# EAGLE design shieldSchematic (EAGLE 7.6.0)
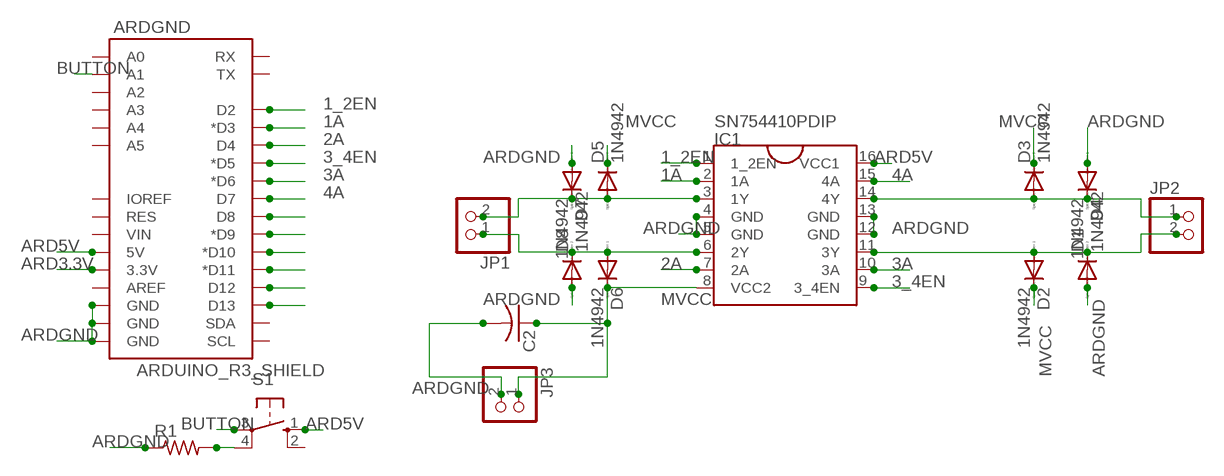
[diagram p0: schematic, sheet 1]

## Parts
ARDGND  ARDUINO_R3_SHIELD  [UNO_R3_SHIELD]
C2  C-US025-024X044  [C025-024X044]
D1  1N4942  [DO41-10]
D2  1N4942  [DO41-10]
D3  1N4942  [DO41-10]
D4  1N4942  [DO41-10]
D5  1N4942  [DO41-10]
D6  1N4942  [DO41-10]
D7  1N4942  [DO41-10]
D8  1N4942  [DO41-10]
IC1  SN754410PDIP  [DIL16]
JP1  PINHD-1X2  [1X02]
JP2  PINHD-1X2  [1X02]
JP3  PINHD-1X2  [1X02]
R1  R-US_0207/10  [0207/10]
S1  40-XX  [B3F-40XX]

## Nets
1_2EN: ARDGND.D2 IC1.1(1_2EN)
1A: ARDGND.D3(*D3) IC1.2(1A)
2A: ARDGND.D4 IC1.7(2A)
3_4EN: ARDGND.D5(*D5) IC1.9(3_4EN)
3A: ARDGND.D6(*D6) IC1.10(3A)
4A: ARDGND.D7 IC1.15(4A)
ARD3.3V: ARDGND.3.3V
ARD5V: ARDGND.5V IC1.16(VCC1) S1.1(S)
ARDGND: ARDGND.GND@0(GND) ARDGND.GND@1(GND) ARDGND.GND@2(GND) C2.2 D1.A D4.A D7.A D8.A IC1.4(GND) IC1.5(GND) IC1.12(GND) IC1.13(GND) JP3.2 R1.1
BUTTON: ARDGND.A1 S1.3(P)
MVCC: C2.1 D2.C D3.C D5.C D6.C IC1.8(VCC2) JP3.1
N$1: D5.A D7.C IC1.3(1Y) JP1.2
N$2: R1.2 S1.4(P1)
N$10: ARDGND.D8
N$11: ARDGND.D9(*D9)
N$12: ARDGND.D10(*D10)
N$13: ARDGND.D11(*D11)
N$14: ARDGND.D12
N$15: ARDGND.D13
N$17: D6.A D8.C IC1.6(2Y) JP1.1
N$18: D1.C D2.A IC1.11(3Y) JP2.2
N$19: D3.A D4.C IC1.14(4Y) JP2.1
Unconnected: ARDGND.A0 ARDGND.A2 ARDGND.A3 ARDGND.A4 ARDGND.A5 ARDGND.AREF ARDGND.IOREF ARDGND.RES ARDGND.RX ARDGND.SCL ARDGND.SDA ARDGND.TX ARDGND.VIN S1.2(S1)

## Library data of the parts
ARDGND = SparkFun-Boards:ARDUINO_R3_SHIELD: Shield form compatible with the Arduino Uno R3.
C2 = rcl:C-US: CAPACITOR, American symbol
D1-D8 = diode:1N4942: DIODE 1.0 A, 200 V, 150 ns
IC1 = AlexW-Eagle-Libraries:SN754410
JP1-JP3 = pinhead:PINHD-1X2: PIN HEADER
R1 = resistor:R-US_: RESISTOR, American symbol
S1 = switch-omron:40-XX: OMRON SWITCH; MF: OMRON COMPONENTS USA; MPN: B3F-4000; OC_FARNELL: 176434; OC_NEWARK: 36K3105

## Board
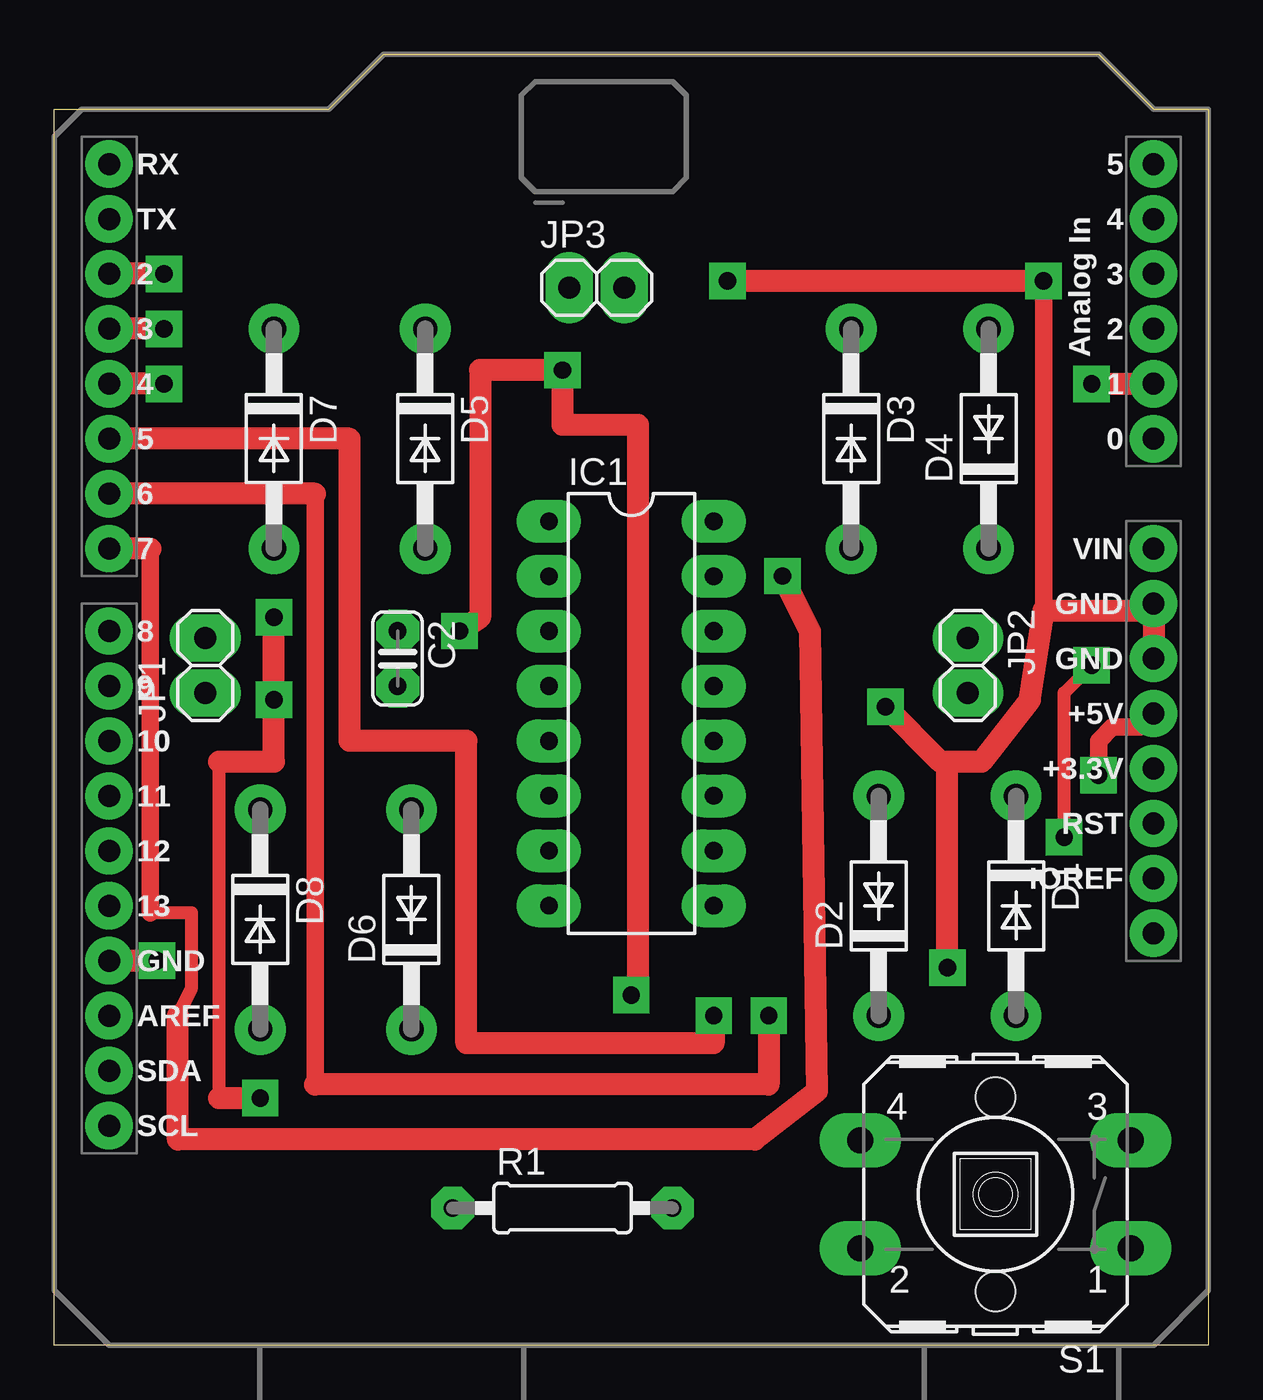
[diagram p1: board, top side]
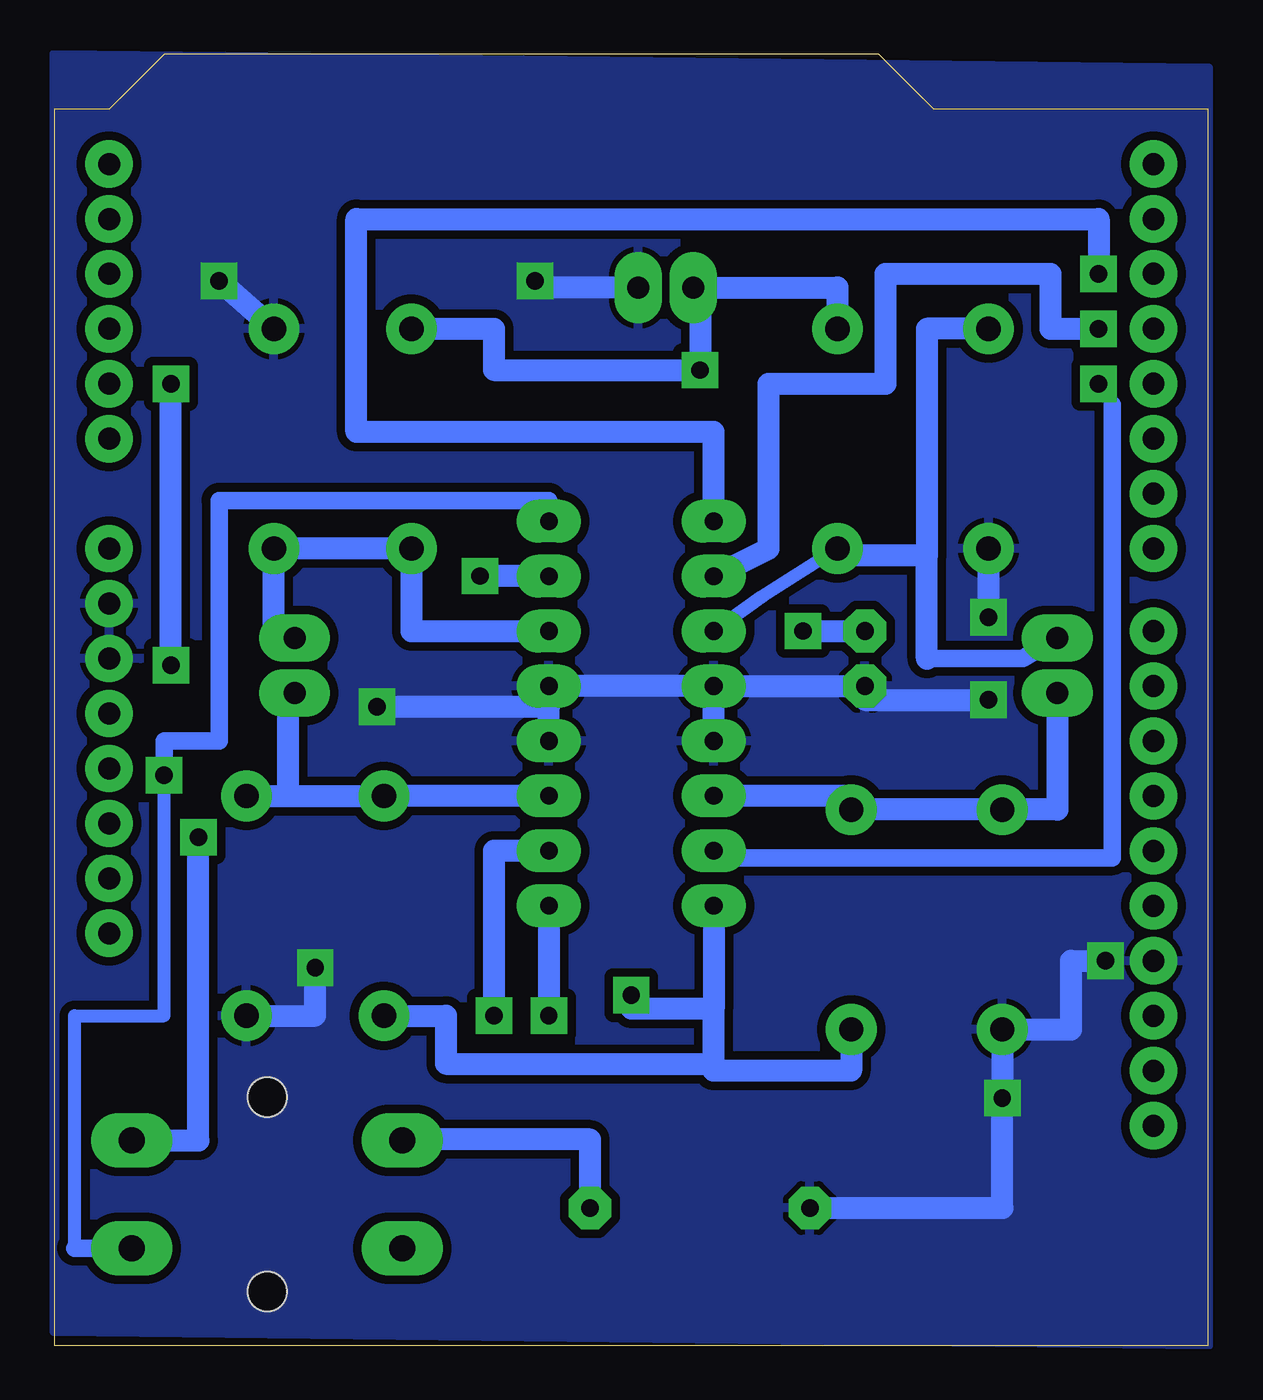
[diagram p2: board, bottom side, seen from below]

Size 53.34 x 59.69 mm. Coordinates in mm from the lower left corner, seen from the top.
Outline: 0,0 0,57.15 12.7,57.15 15.24,59.69 48.26,59.69 50.8,57.15 53.34,57.15 53.34,0 0,0
Copper layers (1*16): Top 0.035mm / dielectric 1.5mm / Bottom 0.035mm
Design rules "OthermillDRC_1_64_v2 *": minimum track width 16mil, minimum drill 31mil, track to track 0.39878125mm, track to pad 0.39878125mm, pad to pad 0.39878125mm, via to via 0.39878125mm, smd to smd 0mil, copper to edge 0mil, drill to drill 1mil, minimum pad ring 23mil, minimum via ring 15mil, stop-mask expansion 1mil, vias tented up to drill 30mil, thermal gap 10mil

### Footprints (pad centres in the part's own frame; a part is rotated, then mirrored left to right if it is on the bottom)
UNO_R3_SHIELD = drill 1.016 pad 1.88: 3.3V 50.8,26.67; 5V 50.8,29.21; A0 50.8,41.91; A1 50.8,44.45; A2 50.8,46.99; A3 50.8,49.53; A4 50.8,52.07; A5 50.8,54.61; AREF 2.54,15.24; D2 2.54,49.53; D3 2.54,46.99; D4 2.54,44.45; D5 2.54,41.91; D6 2.54,39.37; D7 2.54,36.83; D8 2.54,33.02; D9 2.54,30.48; D10 2.54,27.94; D11 2.54,25.4; D12 2.54,22.86; D13 2.54,20.32; GND@0 50.8,31.75; GND@1 50.8,34.29; GND@2 2.54,17.78; IOREF 50.8,21.59; NC 50.8,19.05; RES 50.8,24.13; RX 2.54,54.61; SCL 2.54,10.16; SDA 2.54,12.7; TX 2.54,52.07; VIN 50.8,36.83
C025-024X044 = drill 0.813 octagon: 1 -1.27,0; 2 1.27,0
DO41-10 = drill 1.118: A 5.08,0; C -5.08,0
DIL16 = drill 0.813 long: 1 -8.89,-3.81; 2 -6.35,-3.81; 3 -3.81,-3.81; 4 -1.27,-3.81; 5 1.27,-3.81; 6 3.81,-3.81; 7 6.35,-3.81; 8 8.89,-3.81; 9 8.89,3.81; 10 6.35,3.81; 11 3.81,3.81; 12 1.27,3.81; 13 -1.27,3.81; 14 -3.81,3.81; 15 -6.35,3.81; 16 -8.89,3.81
1X02 = drill 1.016 long: 1 -1.27,0; 2 1.27,0
0207/10 = drill 0.813 octagon: 1 -5.08,0; 2 5.08,0
B3F-40XX = drill 1.194 long: 1 -6.248,2.489; 2 6.248,2.489; 3 -6.248,-2.489; 4 6.248,-2.489 | hole 1.803: 0,-4.496; 0,4.496

### Placement (x,y rotation side)
ARDGND  0,0 0 top
C2  15.88,31.75 270 top
D1  44.45,20.32 270 top
D2  38.1,20.32 90 top
D3  36.83,41.91 270 top
D4  43.18,41.91 90 top
D5  17.14,41.91 270 top
D6  16.51,19.69 90 top
D7  10.16,41.91 270 top
D8  9.52,19.69 270 top
IC1  26.67,29.21 270 top
JP1  6.98,31.43 90 top
JP2  42.23,31.43 270 top
JP3  25.08,48.89 0 top
R1  23.49,6.35 0 top
S1  43.5,6.98 180 top

### Tracks (layer width: path | path; a pad name or v marks a point on that pad's centre or on a via)
1_2EN  (via drill 0.8)
  Top 1.016: v5.08,49.53 ARDGND.D2
  Bottom 1.016: IC1.1 22.86,42.23 39.37,42.23 39.37,52.07 5.08,52.07 v5.08,49.53
1A  (via drill 0.8)
  Top 1.016: v5.08,46.99 ARDGND.D3
  Bottom 1.016: IC1.2 20.32,36.83 20.32,44.45 14.92,44.45 14.92,49.53 7.3,49.53 7.3,46.99 v5.08,46.99
2A  (via drill 0.8)
  Top 1.016: v5.08,44.45 ARDGND.D4
  Bottom 0.61: 4.45,43.5 v5.08,44.45
  Bottom 0.813: IC1.7 22.86,22.54 4.45,22.54 4.45,43.5
3_4EN  (via drill 0.8 pad 0.81)
  Top 1.016: v30.48,15.24 30.48,13.97 19.05,13.97 19.05,27.94 13.65,27.94 13.65,41.91 ARDGND.D5
  Bottom 1.016: IC1.9 v30.48,15.24
3A  (via drill 0.8 pad 0.81)
  Top 0.813: 12.06,12.06 12.06,39.37
  Top 1.016: v33.02,15.24 33.02,12.06 12.06,12.06 | 12.06,39.37 ARDGND.D6
  Bottom 1.016: IC1.10 33.02,22.86 v33.02,15.24
4A  (via drill 0.8 pad 0.81)
  Top 0.61: 5.71,15.24 6.35,16.51 6.35,20 4.45,20
  Top 0.813: 4.45,20 4.45,36.83
  Top 1.016: v33.66,35.56 34.93,33.02 35.24,11.75 32.38,9.52 5.71,9.52 5.71,15.24 | 4.45,36.83 ARDGND.D7
  Bottom 1.016: IC1.15 v33.66,35.56
ARD5V  (via drill 0.8)
  Top 0.813: v48.26,26.35 48.26,27.94 48.9,28.57 50.16,28.57 ARDGND.5V
  Bottom 0.61: 52.39,4.5 52.39,15.24 48.26,15.24 v48.26,26.35
  Bottom 0.813: IC1.16 30.48,39.05 45.72,39.05 45.72,27.94 48.26,27.94 v48.26,26.35 | S1.1 52.39,4.5
ARDGND  (via drill 0.8, 0.8 pad 0.81, 0.8 pad 1.02)
  Top 0.61: 7.62,11.43 7.62,26.99 | 50.8,33.97 ARDGND.GND@1 | 45.4,49.21 v45.72,49.21 | 41.27,26.99 40.96,26.99
  Top 0.813: v45.72,49.21 45.72,33.97
  Top 1.016: v10.16,33.66 v10.16,29.84 10.16,26.99 7.62,26.99 | v9.52,11.43 7.62,11.43 | ARDGND.GND@1 ARDGND.GND@0 | v4.76,17.78 ARDGND.GND@2 | 50.8,33.97 45.72,33.97 45.09,29.84 42.86,26.99 41.27,26.99 v41.27,17.46 | v31.12,49.21 v45.72,49.21 | 40.96,26.99 v38.42,29.53
  Bottom 0.61: C2.2 15.88,29.84 | 31.12,48.89 v31.12,49.21 | 30.48,29.53 IC1.13
  Bottom 1.016: IC1.4 IC1.13 | IC1.12 30.48,29.53 v38.42,29.53 | IC1.5 IC1.4 | IC1.4 C2.2 | 15.88,29.84 v10.16,29.84 | v10.16,33.66 D7.A | R1.1 9.52,6.35 v9.52,11.43 D8.A 6.35,14.6 6.35,17.78 v4.76,17.78 | D4.A v45.72,49.21 | JP3.2 31.12,48.89 | D1.A 41.27,15.24 v41.27,17.46
  pour Bottom: 0,0 53.34,0.63 53.34,59.69 0,59.05
BUTTON  (via drill 0.8)
  Top 0.61: v46.67,23.49 46.67,30.16 v47.94,31.43
  Top 1.016: v47.94,44.45 ARDGND.A1
  Bottom 1.016: S1.3 46.67,9.47 v46.67,23.49 | v47.94,31.43 v47.94,44.45
MVCC  (via drill 0.8)
  Top 1.016: v18.73,33.02 19.69,33.66 19.69,45.09 v23.49,45.09 23.49,42.55 26.99,42.55 26.99,16.19 v26.67,16.19
  Bottom 0.61: JP3.1 23.49,48.89 | 16.19,33.02 C2.1 | 22.86,13.02 22.86,12.7
  Bottom 1.016: JP3.1 17.14,48.89 D5.C | 23.49,48.89 v23.49,45.09 33.02,45.09 33.02,46.99 D3.C | v18.73,33.02 16.19,33.02 | D6.C 16.51,12.7 22.86,12.7 | 22.86,15.56 22.86,13.02 35.24,13.02 35.24,15.24 D2.C | IC1.8 22.86,15.56 | 22.86,15.56 26.67,15.56 v26.67,16.19
N$1
  Bottom 0.406: 17.14,36.51 D5.A
  Bottom 0.61: IC1.3 20.64,34.61 D5.A
  Bottom 0.813: JP1.2 8.57,31.75 13.02,31.75
  Bottom 1.016: 13.02,31.75 13.02,36.51 | 13.02,36.51 17.14,36.51 | D7.C 13.02,46.99 13.02,36.51
N$2
  Bottom 0.406: 37.57,9.52 S1.4
  Bottom 1.016: R1.2 28.57,9.52 37.57,9.52
N$17
  Bottom 0.61: D6.A 16.51,25.4
  Bottom 1.016: D6.A D8.C 6.98,24.77 JP1.1 | 16.51,25.4 IC1.6
N$18
  Bottom 0.406: D1.C 43.18,25.4
  Bottom 0.813: JP2.2 42.54,30.16
  Bottom 1.016: IC1.11 D2.A 42.54,25.4 | D1.C 42.54,25.4 | 42.54,30.16 42.54,25.4
N$19
  Bottom 1.016: IC1.14 36.83,33.02 D3.A D4.C 43.18,32.7 JP2.1